# EAGLE design schema_v1 (EAGLE 7.6.0)
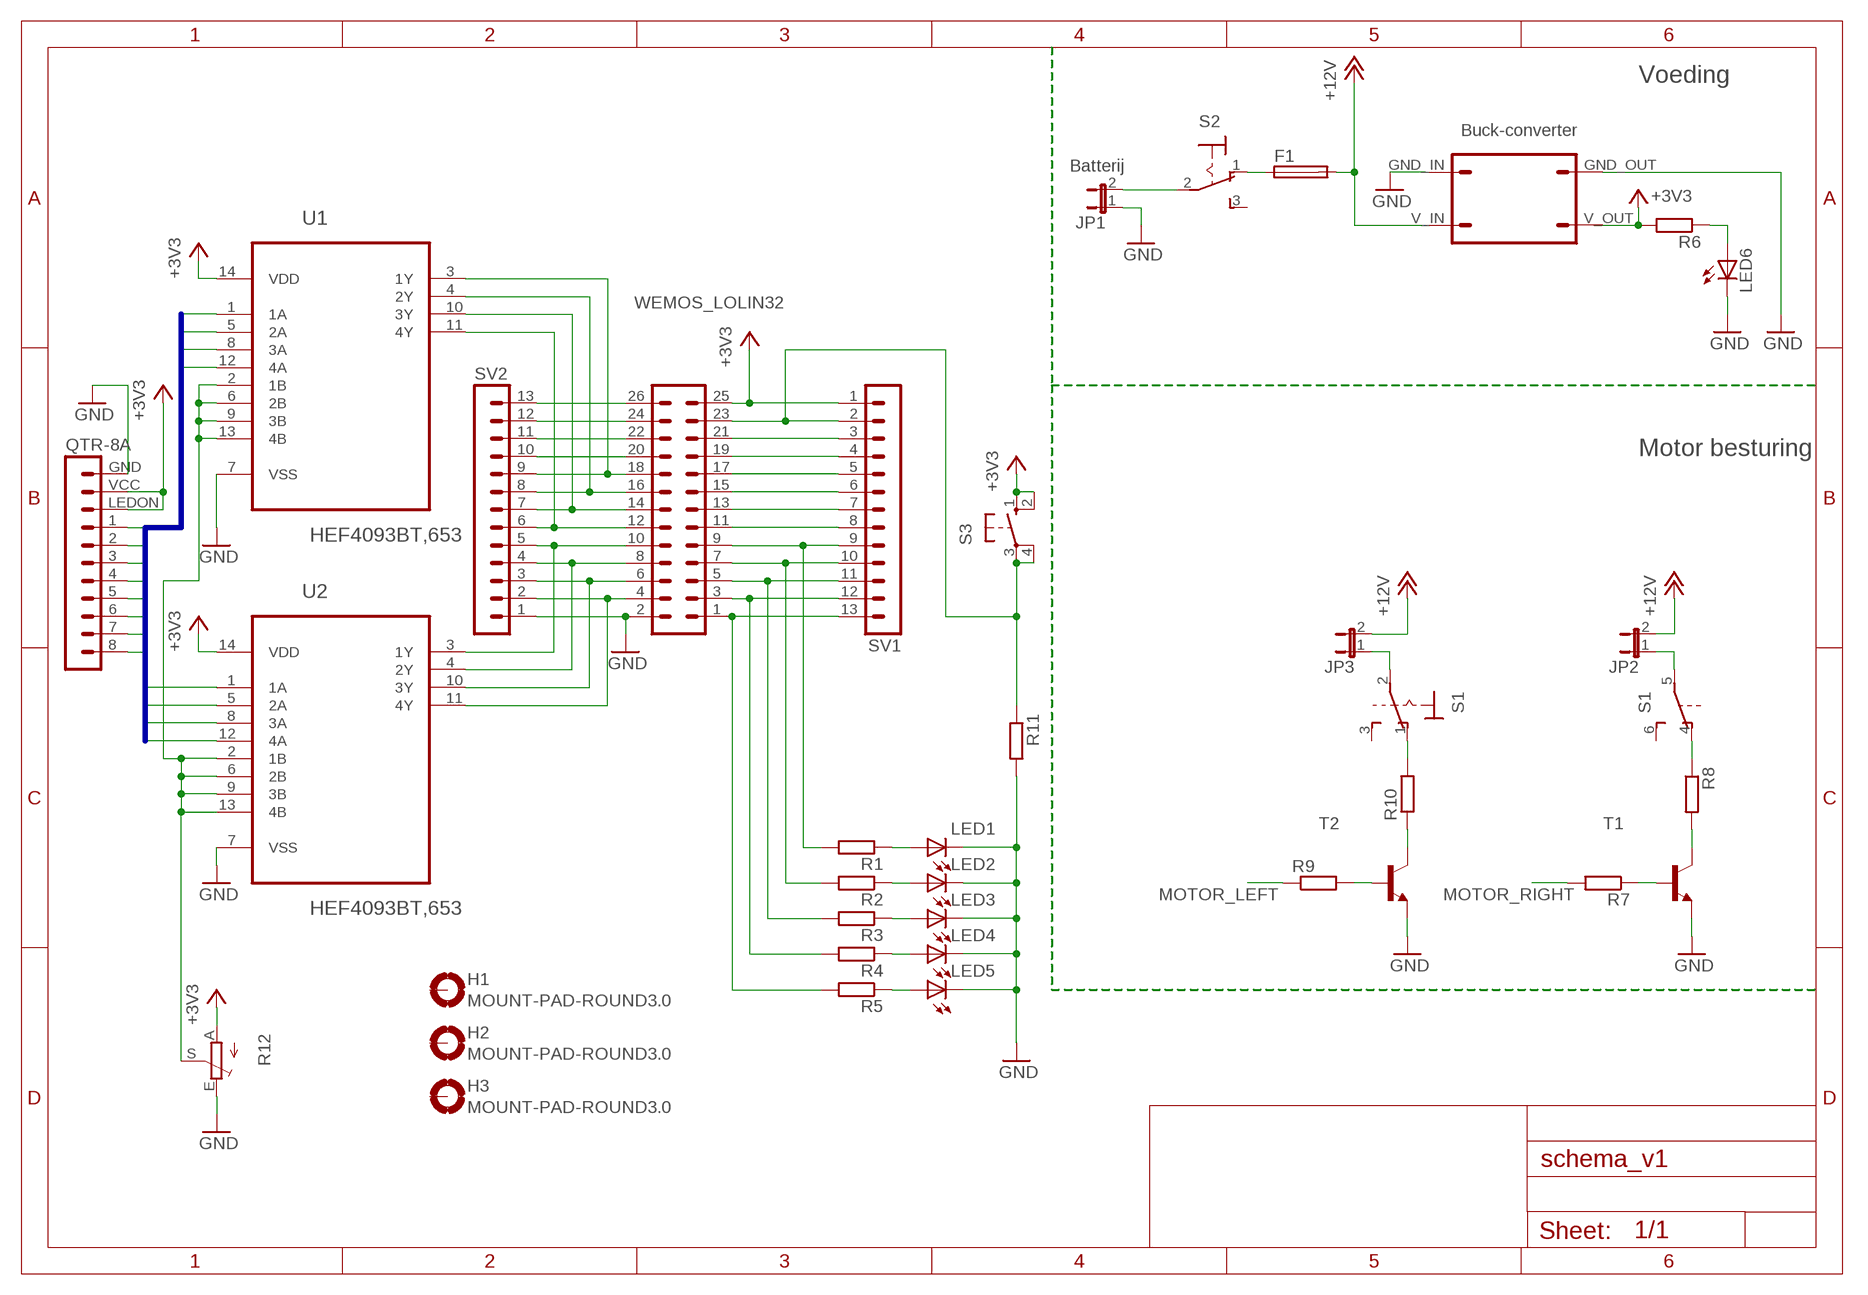
[diagram p0: schematic, sheet 1]

## Parts
F1  SH22,5A  [SH22,5A]
H1  MOUNT-PAD-ROUND3.0  [3,0-PAD]
H2  MOUNT-PAD-ROUND3.0  [3,0-PAD]
H3  MOUNT-PAD-ROUND3.0  [3,0-PAD]
JP1  JP1E  [JP1]
JP2  JP1E  [JP1]
JP3  JP1E  [JP1]
LED1  LEDSMT1206  [1206]
LED2  LEDSMT1206  [1206]
LED3  LEDSMT1206  [1206]
LED4  LEDSMT1206  [1206]
LED5  LEDSMT1206  [1206]
LED6  LEDSMT1206  [1206]
QTR-8A  WEMOS-LOLIN32_QTR-8A  [WEMOS-LOLIN32_MA10-1]
R1  R-EU_M0805  [M0805]
R2  R-EU_M0805  [M0805]
R3  R-EU_M0805  [M0805]
R4  R-EU_M0805  [M0805]
R5  R-EU_M0805  [M0805]
R6  R-EU_M0805  [M0805]
R7  R-EU_M0805  [M0805]
R8  R-EU_M0805  [M0805]
R9  R-EU_M0805  [M0805]
R10  R-EU_M0805  [M0805]
R11  R-EU_M0805  [M0805]
R12  POT_TRIM_EU-CA6V  [POT_CA6V]
S1  SWITCH_320-938  [SWITCH_320-938]
S2  SWITCH_320-916  [SWITCH_320-916]
S3  SWITCH-OMRON_10-XX  [SWITCH-OMRON_B3F-10XX]
SV1  MA13-1  [MA13-1]
SV2  MA13-1  [MA13-1]
T1  TRANSISTOR-NPN-LINE-FOLLOWER_2N2222  [TRANSISTOR-NPN-LINE-FOLLOWER_TO92-CBE]
T2  TRANSISTOR-NPN-LINE-FOLLOWER_2N2222  [TRANSISTOR-NPN-LINE-FOLLOWER_TO92-CBE]
U1  HEF4093BT,653  [SOIC127P600X175-14N]
U2  HEF4093BT,653  [SOIC127P600X175-14N]
U$2  COMPONENTEN-AANMAKEN_BUCK-CONVERTER  [COMPONENTEN-AANMAKEN_MA04-1_BUCK]
WEMOS_LOLIN32  WEMOS-LOLIN32_WEMOS_LOLIN32  [WEMOS-LOLIN32_MA13-2]

## Nets
+3V3: QTR-8A.LEDON QTR-8A.VCC R6.2 R12.A S3.1(S) S3.2(S1) SV1.1 U1.14(VDD) U2.14(VDD) U$2.V_OUT WEMOS_LOLIN32.25
+12V: F1.2 JP2.2 JP3.2 U$2.V_IN
ANALOG_BUS1: QTR-8A.1 U1.1(1A)
ANALOG_BUS2: QTR-8A.2 U1.5(2A)
ANALOG_BUS3: QTR-8A.3 U1.8(3A)
ANALOG_BUS4: QTR-8A.4 U1.12(4A)
ANALOG_BUS5: QTR-8A.5 U2.1(1A)
ANALOG_BUS6: QTR-8A.6 U2.5(2A)
ANALOG_BUS7: QTR-8A.7 U2.8(3A)
ANALOG_BUS8: QTR-8A.8 U2.12(4A)
GND: JP1.1 LED1.C LED2.C LED3.C LED4.C LED5.C LED6.C QTR-8A.GND R11.2 R12.E SV2.1 T1.E T2.E U1.7(VSS) U2.7(VSS) U$2.GND_IN U$2.GND_OUT WEMOS_LOLIN32.2
MOTOR_LEFT: R9.1 SV1.6 WEMOS_LOLIN32.15
MOTOR_RIGHT: R7.2 SV1.7 WEMOS_LOLIN32.13
N$1: JP1.2 S2.2(P)
N$2: F1.1 S2.1(O)
N$3: SV2.9 U1.3(1Y) WEMOS_LOLIN32.18
N$4: LED6.A R6.1
N$5: SV2.8 U1.4(2Y) WEMOS_LOLIN32.16
N$6: SV2.7 U1.10(3Y) WEMOS_LOLIN32.14
N$7: SV2.6 U1.11(4Y) WEMOS_LOLIN32.12
N$8: SV2.2 U2.11(4Y) WEMOS_LOLIN32.4
N$9: LED1.A R1.1
N$10: LED2.A R2.1
N$11: LED3.A R3.1
N$12: LED4.A R4.1
N$13: LED5.A R5.1
N$14: R11.1 S3.3(P) S3.4(P1) SV1.2 WEMOS_LOLIN32.23
N$15: JP3.1 S1.2(1:P)
N$16: R10.2 S1.1(1:O)
N$17: R10.1 T2.C
N$18: R9.2 T2.B
N$19: JP2.1 S1.5(B:P)
N$20: R8.1 S1.4(B:O)
N$21: R8.2 T1.C
N$22: R7.1 T1.B
N$23: SV2.3 U2.10(3Y) WEMOS_LOLIN32.6
N$24: SV2.4 U2.4(2Y) WEMOS_LOLIN32.8
N$25: SV2.5 U2.3(1Y) WEMOS_LOLIN32.10
N$26: SV2.10 WEMOS_LOLIN32.20
N$27: SV2.11 WEMOS_LOLIN32.22
N$28: SV2.12 WEMOS_LOLIN32.24
N$29: SV2.13 WEMOS_LOLIN32.26
N$30: R5.2 SV1.13 WEMOS_LOLIN32.1
N$31: R12.S U1.2(1B) U1.6(2B) U1.9(3B) U1.13(4B) U2.2(1B) U2.6(2B) U2.9(3B) U2.13(4B)
N$32: R4.2 SV1.12 WEMOS_LOLIN32.3
N$33: R3.2 SV1.11 WEMOS_LOLIN32.5
N$35: R2.2 SV1.10 WEMOS_LOLIN32.7
N$36: R1.2 SV1.9 WEMOS_LOLIN32.9
N$38: SV1.3 WEMOS_LOLIN32.21
N$39: SV1.4 WEMOS_LOLIN32.19
N$40: SV1.5 WEMOS_LOLIN32.17
N$43: SV1.8 WEMOS_LOLIN32.11
Unconnected: H1.B3,0(MOUNT) H2.B3,0(MOUNT) H3.B3,0(MOUNT) S1.3(1:S) S1.6(B:S) S2.3(S)

## Buses
ANALOG_BUS[1..8]

## Notes on the sheet
- Voeding
- Buck-converter
- Batterij
- Motor besturing

## Library data of the parts
F1 = fuse:SH22,5A: FUSE HOLDER grid 22,5mm, isolated cap OGN0031 8201, Schurter (Buerklin); MPN: 0031.7701.11; OC_FARNELL: unknown; OC_NEWARK: 04F1224
H1-H3 = holes:MOUNT-PAD-ROUND: MOUNTING PAD, round
JP1-JP3 = schema 2017-02-28:JP1E: JUMPER
LED1-LED6 = led:LED: LED OSRAM: - CHIPLED LG R971, LG N971, LY N971, LG Q971, LY Q971, LO R971, LY R971 LH N974, LH R974 LS Q976, LO Q976, LY Q976 LO Q996 - Hyper CHIPLED LW Q18S LB Q993, LB Q99A, LB R99A - SideLED LS A670, LO A670, LY A670, LG A670, LP A670 LB A673, LV A673, LT A673, LW A673 LH A674 LY A675 LS A676, LA A676, LO A676, LY A676, LW A676 LS A679, LY A679, LG A679 - Hyper Micro SIDELED® LS Y876, LA Y876, LO Y876, LY Y876 LT Y87S - SmartLED LW L88C, LW L88S LB L89C, LB L89S, LG L890 LS L89K, LO L89K, LY L89K LS L896, LA L896, LO L896, LY L896 - TOPLED LS T670, LO T670, LY T670, LG T670, LP T670 LSG T670, LSP T670, LSY T670, LOP T670, LYG T670 LG T671, LOG T671, LSG T671 LB T673, LV T673, LT T673, LW T673 LH T674 LS T676, LA T676, LO T676, LY T676, LB T676, LH T676, LSB T676, LW T676 LB T67C, LV T67C, LT T67C, LS T67K, LO T67K, LY T67K, LW E67C LS E67B, LA E67B, LO E67B, LY E67B, LB E67C, LV E67C, LT E67C LW T67C LS T679, LY T679, LG T679 LS T770, LO T770, LY T770, LG T770, LP T770 LB T773, LV T773, LT T773, LW T773 LH T774 LS E675, LA E675, LY E675, LS T675 LS T776, LA T776, LO T776, LY T776, LB T776 LHGB T686 LT T68C, LB T68C - Hyper Mini TOPLED® LB M676 - Mini TOPLED Santana® LG M470 LS M47K, LO M47K, LY M47K Source: http://www.osram.convergy.de LUXEON: - LUMILED® LXK2-PW12-R00, LXK2-PW12-S00, LXK2-PW14-U00, LXK2-PW14-V00 LXK2-PM12-R00, LXK2-PM12-S00, LXK2-PM14-U00 LXK2-PE12-Q00, LXK2-PE12-R00, LXK2-PE12-S00, LXK2-PE14-T00, LXK2-PE14-U00 LXK2-PB12-K00, LXK2-PB12-L00, LXK2-PB12-M00, LXK2-PB14-N00, LXK2-PB14-P00, LXK2-PB14-Q00 LXK2-PR12-L00, LXK2-PR12-M00, LXK2-PR14-Q00, LXK2-PR14-R00 LXK2-PD12-Q00, LXK2-PD12-R00, LXK2-PD12-S00 LXK2-PH12-R00, LXK2-PH12-S00 LXK2-PL12-P00, LXK2-PL12-Q00, LXK2-PL12-R00 Source: www.luxeon.com KINGBRIGHT: KA-3528ASYC Source: www.kingbright.com
QTR-8A = schema:WEMOS-LOLIN32_QTR-8A: PIN HEADER; OC_FARNELL: unknown; OC_NEWARK: unknown
R1-R11 = resistor:R-EU_: RESISTOR, European symbol
R12 = schema:POT_TRIM_EU-: POTENTIOMETER
S1 = schema:SWITCH_320-938: TOGGLE SWITCH distributor RS Components
S2 = schema:SWITCH_320-916: TOGGLE SWITCH distributor RS Components
S3 = schema:SWITCH-OMRON_10-XX: OMRON SWITCH; MPN: B3F-1000; OC_FARNELL: 176432; OC_NEWARK: 36M3542
SV1 SV2 = con-lstb:MA13-1: PIN HEADER; OC_FARNELL: unknown; OC_NEWARK: unknown
T1 T2 = schema:TRANSISTOR-NPN-LINE-FOLLOWER_2N2222: NPN Transistor
U1 U2 = HEF4093:HEF4093BT,653: Quad 2-input NAND Schmitt trigger; MPN: HEF4093BT,653; OC_FARNELL: 1826634; OC_NEWARK: 78R7394; PACKAGE: SOIC-14; SUPPLIER: NXP
U$2 = schema:COMPONENTEN-AANMAKEN_BUCK-CONVERTER
WEMOS_LOLIN32 = schema:WEMOS-LOLIN32_WEMOS_LOLIN32

## Board
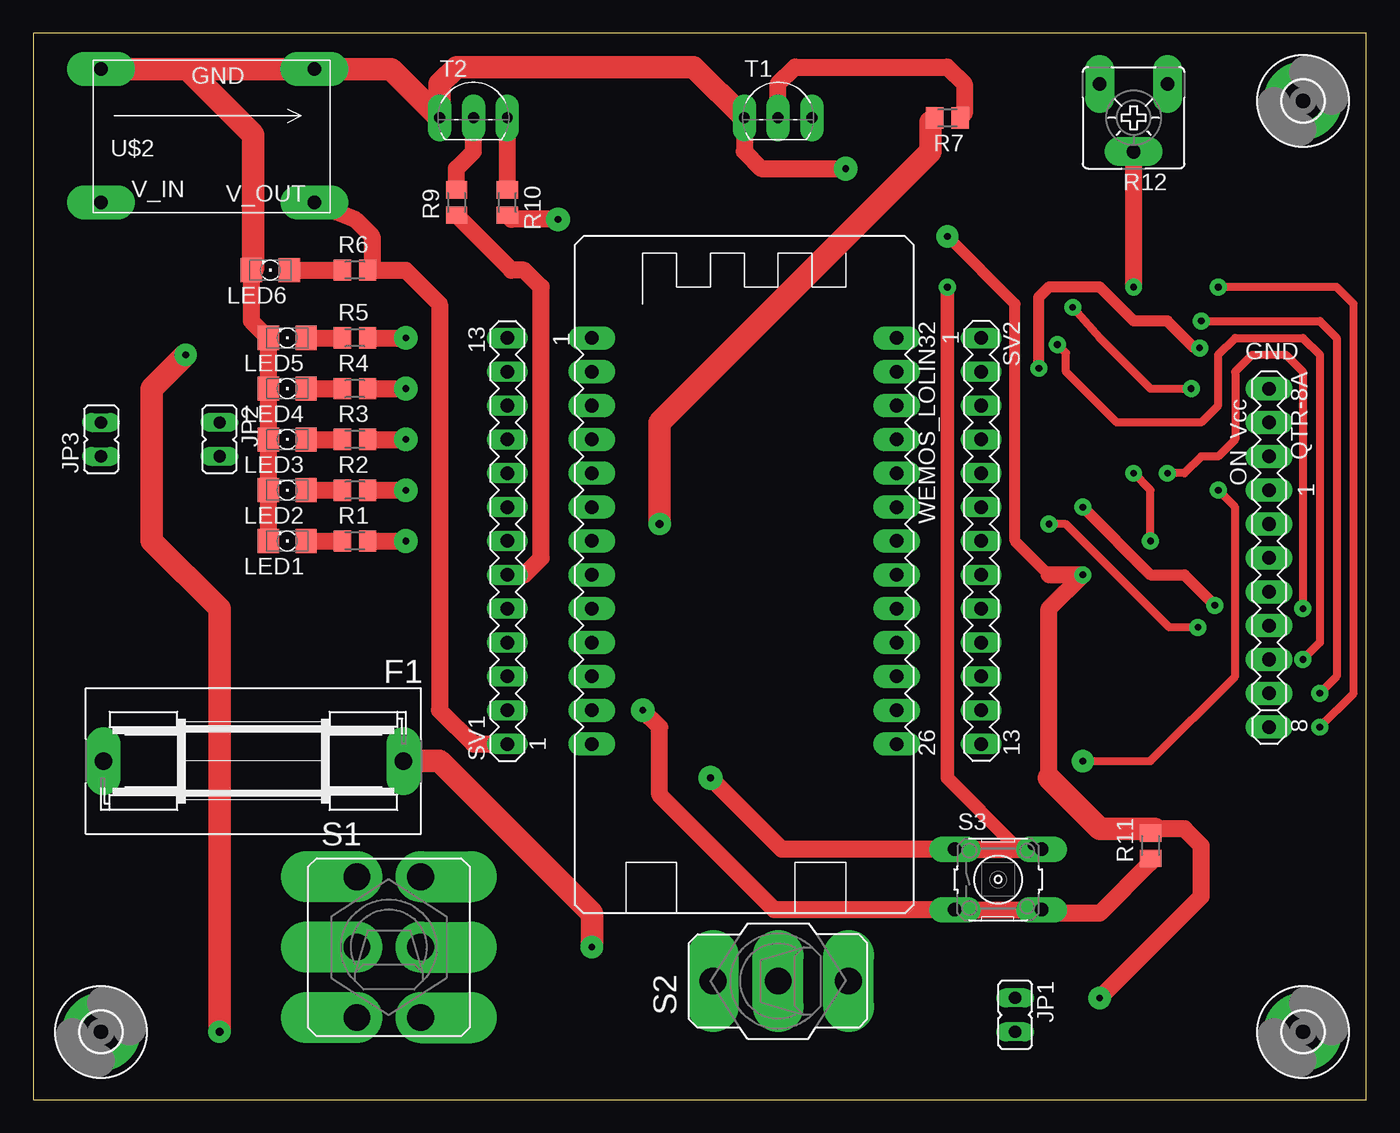
[diagram p1: board, top side]
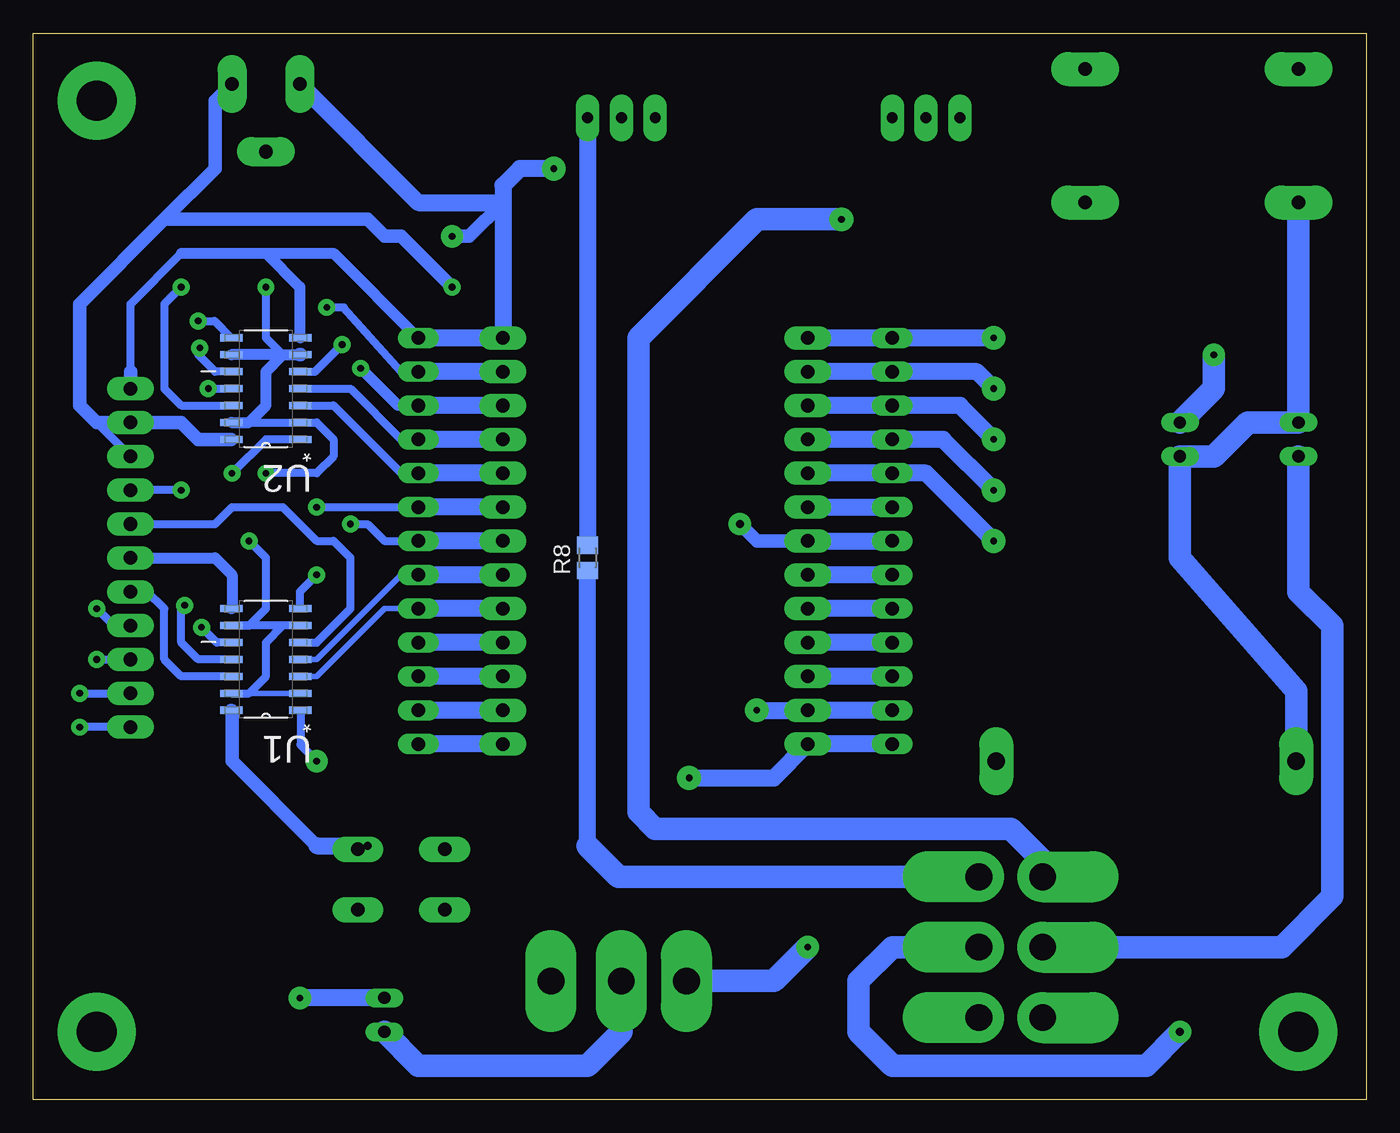
[diagram p2: board, bottom side, seen from below]

Size 100 x 80 mm. Coordinates in mm from the lower left corner, seen from the top.
Outline: 0,0 100,0 100,80 0,80 0,0
Copper layers (1*16): Top 0.035mm / dielectric 1.5mm / Bottom 0.035mm
Design rules "default": minimum track width 6mil, minimum drill 0.35mm, track to track 6mil, track to pad 6mil, pad to pad 6mil, via to via 6mil, smd to smd 6mil, copper to edge 40mil, drill to drill 6mil, minimum pad ring 10mil, minimum via ring 8mil, stop-mask expansion 4mil, vias tented up to drill 0mil, thermal gap 10mil

### Footprints (pad centres in the part's own frame; a part is rotated, then mirrored left to right if it is on the bottom)
SH22,5A = drill 1.321 pad 2.54 long: 1 -11.252,0; 2 11.252,0
3,0-PAD = drill 3 pad 5.842: B3,0 0,0
JP1 = drill 0.914 long: 1 0,-1.27; 2 0,1.27
1206 = smd 1.6 x 1.803: A -1.422,0; C 1.422,0
WEMOS-LOLIN32_MA10-1 = drill 1.016 pad 1.778 long: 1 -3.81,0; 2 -1.27,0; 3 1.27,0; 4 3.81,0; 5 6.35,0; 6 8.89,0; 7 11.43,0; 8 13.97,0; GND -11.43,0; LEDON -6.35,0; VCC -8.89,0
M0805 = smd 1.3 x 1.6: 1 -0.95,0; 2 0.95,0
POT_CA6V = drill 1.016 pad 2.184 long: A -2.54,-2.54; E 2.54,-2.54; S 0,2.54
SWITCH_320-938 = drill 2.007 pad 3.81 offset: 1 -2.388,5.283; 2 -2.388,0; 3 -2.388,-5.283; 4 2.388,5.283; 5 2.388,0; 6 2.388,-5.283
SWITCH_320-916 = drill 2.007 pad 3.81 long: 1 0,4.877; 2 0,0; 3 0,-5.283
SWITCH-OMRON_B3F-10XX = drill 1.016 pad 1.93 long: 1 -3.251,2.261; 2 3.251,2.261; 3 -3.251,-2.261; 4 3.251,-2.261
MA13-1 = drill 1.016 long: 1 -15.24,0; 2 -12.7,0; 3 -10.16,0; 4 -7.62,0; 5 -5.08,0; 6 -2.54,0; 7 0,0; 8 2.54,0; 9 5.08,0; 10 7.62,0; 11 10.16,0; 12 12.7,0; 13 15.24,0
TRANSISTOR-NPN-LINE-FOLLOWER_TO92-CBE = drill 0.813 pad 1.778 long: B 0,0; C 2.54,0; E -2.54,0
SOIC127P600X175-14N = smd 1.702 x 0.533: 1 -2.591,3.81; 2 -2.591,2.54; 3 -2.591,1.27; 4 -2.591,0; 5 -2.591,-1.27; 6 -2.591,-2.54; 7 -2.591,-3.81; 8 2.591,-3.81; 9 2.591,-2.54; 10 2.591,-1.27; 11 2.591,0; 12 2.591,1.27; 13 2.591,2.54; 14 2.591,3.81
COMPONENTEN-AANMAKEN_MA04-1_BUCK = drill 1.016 pad 2.54 long: GND_IN 0,10; GND_OUT 16,10; V_IN 0,0; V_OUT 16,0
WEMOS-LOLIN32_MA13-2 = drill 1.016 pad 1.778 long: 1 -15.24,-1.27; 2 -15.24,21.59; 3 -12.7,-1.27; 4 -12.7,21.59; 5 -10.16,-1.27; 6 -10.16,21.59; 7 -7.62,-1.27; 8 -7.62,21.59; 9 -5.08,-1.27; 10 -5.08,21.59; 11 -2.54,-1.27; 12 -2.54,21.59; 13 0,-1.27; 14 0,21.59; 15 2.54,-1.27; 16 2.54,21.59; 17 5.08,-1.27; 18 5.08,21.59; 19 7.62,-1.27; 20 7.62,21.59; 21 10.16,-1.27; 22 10.16,21.59; 23 12.7,-1.27; 24 12.7,21.59; 25 15.24,-1.27; 26 15.24,21.59

### Placement (x,y rotation side)
F1  16.51,25.4 180 top
H1  95.25,5.08 0 top
H2  95.25,74.93 0 top
H3  5.08,5.08 0 top
JP1  73.66,6.35 180 top
JP2  13.97,49.53 180 top
JP3  5.08,49.53 0 top
LED1  19.05,41.91 180 top
LED2  19.05,45.72 180 top
LED3  19.05,49.53 180 top
LED4  19.05,53.34 180 top
LED5  19.05,57.15 180 top
LED6  17.78,62.23 180 top
QTR-8A  92.71,41.91 270 top
R1  24.13,41.91 0 top
R2  24.13,45.72 0 top
R3  24.13,49.53 0 top
R4  24.13,53.34 0 top
R5  24.13,57.15 0 top
R6  24.13,62.23 0 top
R7  68.58,73.66 180 top
R8  58.42,40.64 90 bottom
R9  31.75,67.31 90 top
R10  35.56,67.31 270 top
R11  83.82,19.05 90 top
R12  82.55,73.66 180 top
S1  26.67,11.43 0 top
S2  55.88,8.89 90 top
S3  72.39,16.51 0 top
SV1  35.56,41.91 90 top
SV2  71.12,41.91 270 top
T1  55.88,73.66 0 top
T2  33.02,73.66 0 top
U1  82.55,33.02 180 bottom
U2  82.55,53.34 180 bottom
U$2  5.08,67.31 0 top
WEMOS_LOLIN32  43.18,41.91 270 top

### Tracks (layer width: path | path; a pad name or v marks a point on that pad's centre or on a via)
+3V3  (via drill 0.5 pad 1.27, 0.5 pad 1.78, 0.6)
  Top 1.016: v68.58,60.96 68.58,24.13 73.66,19.05 | S3.2 73.94,18.77 73.66,19.05 | 73.66,19.05 v74.93,19.05
  Top 1.27: U$2.V_OUT 24.13,66.04 25.4,64.77 25.4,62.55 R6.2 27.94,62.23 30.48,59.69 30.48,29.21 33.02,26.67 SV1.1 | S3.2 S3.1 56.16,18.77 v50.8,24.13
  Bottom 0.61: QTR-8A.LEDON 95.25,50.8
  Bottom 1.016: R12.A 86.36,74.93 86.36,69.85 90.17,66.04 | 90.17,66.04 96.52,59.69 96.52,52.07 95.25,50.8 QTR-8A.VCC 88.9,50.8 87.63,49.53 U2.14 | v68.58,60.96 72.39,64.77 73.66,64.77 74.93,66.04 90.17,66.04 | 78.74,19.05 85.09,25.4 85.09,29.16 U1.14
  Bottom 1.27: SV1.1 WEMOS_LOLIN32.25 44.45,24.13 v50.8,24.13 | 78.74,19.05 v74.93,19.05
+12V
  Bottom 1.676: U$2.V_IN JP3.2 8.89,50.8 11.43,48.26 JP2.2 13.97,40.64 5.26,30.66 F1.2
ANALOG_BUS1  (via drill 0.5 pad 1.27, 0.5 pad 1.68)
  Top 0.61: v78.74,25.4 83.82,25.4 90.17,31.75 90.17,44.45 v88.9,45.72
  Bottom 0.61: U1.1 79.96,26.62 v78.74,25.4 | v88.9,45.72 QTR-8A.1
ANALOG_BUS2
  Bottom 0.61: U1.5 78.74,34.29 76.2,36.83 76.2,40.64 77.47,41.91 78.74,41.91 81.28,44.45 85.09,44.45 86.36,43.18 QTR-8A.2
ANALOG_BUS3
  Bottom 0.813: QTR-8A.3 86.36,40.64 85.09,39.37 85.09,36.88 U1.8
ANALOG_BUS4
  Bottom 0.61: U1.12 88.9,31.75 90.17,33.02 90.17,36.83 91.44,38.1 QTR-8A.4
ANALOG_BUS5  (via drill 0.5 pad 1.27)
  Top 0.61: v95.25,36.83 95.25,54.61 93.98,55.88 91.44,55.88 90.17,54.61 90.17,49.53 88.9,48.26 87.63,48.26 86.36,46.99 v85.09,46.99
  Bottom 0.61: U2.1 82.55,49.53 v85.09,46.99 | v95.25,36.83 93.98,35.56 QTR-8A.5
ANALOG_BUS6  (via drill 0.5 pad 1.27)
  Top 0.61: v95.25,33.02 96.52,34.29 96.52,55.88 95.25,57.15 90.17,57.15 88.9,55.88 88.9,52.07 87.63,50.8 81.28,50.8 77.47,54.61 77.47,56.01 v76.83,56.64
  Bottom 0.61: v95.25,33.02 QTR-8A.6 | U2.5 78.87,54.61 v76.83,56.64
ANALOG_BUS7  (via drill 0.5 pad 1.27)
  Top 0.61: v87.63,58.42 96.52,58.42 97.79,57.15 97.79,31.75 v96.52,30.48
  Bottom 0.61: v96.52,30.48 QTR-8A.7 | v87.63,58.42 86.41,58.42 U2.8
ANALOG_BUS8  (via drill 0.5 pad 1.27)
  Top 0.61: v96.52,27.94 99.06,30.48 99.06,59.69 97.79,60.96 v88.9,60.96
  Bottom 0.61: QTR-8A.8 v96.52,27.94 | v88.9,60.96 90.17,59.69 90.17,53.34 88.9,52.07 U2.12
GND  (via drill 0.5 pad 1.27, 0.5 pad 1.68, 0.5 pad 1.78)
  Top 0.813: 76.2,39.37 73.66,41.91 73.66,59.69 v68.58,64.77
  Top 1.27: LED1.C LED2.C LED3.C LED4.C LED5.C 16.36,58.42 LED6.C 16.51,62.38 | v80.01,7.62 87.63,15.24 87.63,19.05 86.36,20.32 84.14,20.32 R11.2 | U$2.GND_OUT 20.16,77.31 | U$2.GND_IN 11.59,77.31 | T1.E 53.34,71.12 54.61,69.85 v60.96,69.85 | 76.2,24.13 76.2,36.83 v78.74,39.37 76.2,39.37
  Top 1.676: U$2.GND_OUT 26.83,77.31 T2.E 30.48,76.2 31.75,77.47 49.53,77.47 T1.E | 16.51,62.38 16.51,72.39 11.59,77.31 | 84.14,20.32 80.01,20.32 76.2,24.13 | 20.16,77.31 U$2.GND_IN
  Bottom 0.61: v78.74,39.37 80.01,38.1 80.01,36.88 U1.7 | 92.71,54.61 92.71,59.69 88.9,63.5
  Bottom 0.813: 88.9,63.5 82.55,63.5 | U2.7 80.01,57.2 80.01,60.96 82.55,63.5 | 82.55,63.5 77.47,63.5 SV2.1
  Bottom 1.016: QTR-8A.GND 92.71,54.61 | v68.58,64.77 67.31,64.77 64.77,67.31
  Bottom 1.27: SV2.1 WEMOS_LOLIN32.2 64.77,67.31 | v60.96,69.85 63.5,69.85 64.77,68.58 64.77,67.31 | R12.E 71.12,67.31 64.77,67.31 | JP1.1 v80.01,7.62
MOTOR_LEFT
  Top 1.27: SV1.6 36.83,39.37 38.1,40.64 38.1,60.96 36.83,62.23 35.88,62.23 R9.1
  Bottom 1.27: SV1.6 WEMOS_LOLIN32.15
MOTOR_RIGHT  (via drill 0.6 pad 1.68)
  Top 1.016: 67.31,73.34 R7.2
  Top 1.676: v46.99,43.18 46.99,50.8 67.31,71.12 67.31,73.34
  Bottom 1.016: WEMOS_LOLIN32.13 45.72,41.91 v46.99,43.18
  Bottom 1.27: WEMOS_LOLIN32.13 SV1.7
N$1
  Bottom 1.676: S2.2 55.88,5.08 58.42,2.54 71.12,2.54 JP1.2
N$2  (via drill 0.5 pad 1.68)
  Top 1.676: F1.1 30.48,25.4 41.91,13.97 v41.91,11.43
  Bottom 1.676: S2.1 44.45,8.89 v41.91,11.43
N$3
  Bottom 0.406: U1.3 78.74,31.75 73.66,36.83 SV2.9
  Bottom 1.27: WEMOS_LOLIN32.18 SV2.9
N$4
  Top 1.27: LED6.A R6.1
N$5
  Bottom 0.406: U1.4 78.74,33.02 72.39,39.37 SV2.8
  Bottom 1.27: WEMOS_LOLIN32.16 SV2.8
N$6  (via drill 0.5 pad 1.27)
  Top 0.61: v76.2,43.18 77.47,43.18 85.22,35.43 v87.38,35.43
  Bottom 0.61: v76.2,43.18 74.93,43.18 73.66,41.91 SV2.7 | U1.10 86.23,34.29 v87.38,35.43
  Bottom 1.27: WEMOS_LOLIN32.14 SV2.7
N$7  (via drill 0.5 pad 1.27)
  Top 0.813: v78.74,44.45 83.82,39.37 86.36,39.37 v88.65,37.08
  Bottom 0.61: v78.74,44.45 SV2.6 | U1.11 87.63,33.02 88.9,34.29 88.9,36.83 v88.65,37.08
  Bottom 1.27: WEMOS_LOLIN32.12 SV2.6
N$8  (via drill 0.5 pad 1.27)
  Top 0.61: v77.98,59.44 80.01,57.15 83.82,53.34 v86.87,53.34
  Bottom 0.61: SV2.2 72.39,54.61 76.71,59.44 v77.98,59.44 | v86.87,53.34 U2.11
  Bottom 1.27: WEMOS_LOLIN32.4 SV2.2
N$9
  Top 1.27: LED1.A R1.1
N$10
  Top 1.27: LED2.A R2.1
N$11
  Top 1.27: LED3.A R3.1
N$12
  Top 1.27: LED4.A R4.1
N$13
  Top 1.27: LED5.A R5.1
N$14  (via drill 0.5 pad 1.78)
  Top 1.27: R11.1 83.82,17.78 80.01,13.97 75.92,13.97 S3.4 S3.3 55.6,14.25 46.99,22.86 46.99,27.94 v45.72,29.21
  Bottom 1.27: SV1.2 WEMOS_LOLIN32.23 v45.72,29.21
N$15
  Bottom 1.676: S1.2 6.35,11.43 2.54,15.24 2.54,35.56 5.08,38.1 JP3.1
N$16  (via drill 0.5 pad 1.78)
  Top 1.27: v39.37,66.04 35.88,66.04 R10.2
  Bottom 1.676: S1.1 24.28,17.93 26.67,20.32 53.34,20.32 54.61,21.59 54.61,57.15 45.72,66.04 v39.37,66.04
N$17
  Top 1.27: T2.C R10.1
N$18
  Top 1.27: R9.2 31.75,69.85 33.02,71.12 T2.B
N$19  (via drill 0.5 pad 1.68, 0.6 pad 1.68)
  Top 1.676: v13.97,5.08 13.97,36.83 8.89,41.91 8.89,53.34 v11.43,55.88
  Bottom 1.676: S1.5 35.56,11.43 38.1,8.89 38.1,5.08 35.56,2.54 16.51,2.54 v13.97,5.08 | v11.43,55.88 11.43,53.34 JP2.1
N$20
  Bottom 1.27: 58.42,19.05 R8.1
  Bottom 1.676: S1.4 56.08,16.71 58.42,19.05
N$21
  Bottom 1.27: T1.C R8.2
N$22
  Top 1.27: T1.B 55.88,76.2 57.15,77.47 68.58,77.47 69.85,76.2 69.85,73.98 R7.1
N$23  (via drill 0.5 pad 1.27)
  Top 0.61: v87.5,56.39 87.12,56.39
  Top 0.813: 87.12,56.39 85.09,58.42 82.55,58.42 80.01,60.96 76.2,60.96 75.44,60.2 v75.44,54.86
  Bottom 0.61: U2.10 86.36,54.61 87.63,55.88 87.63,56.26 v87.5,56.39 | 72.39,52.07 72.64,52.07
  Bottom 0.813: SV2.3 72.39,52.07 | 72.64,52.07 v75.44,54.86
  Bottom 1.27: WEMOS_LOLIN32.6 SV2.3
N$24
  Bottom 0.61: U2.4 76.2,53.34 72.39,49.53 SV2.4
  Bottom 1.27: WEMOS_LOLIN32.8 SV2.4
N$25
  Bottom 0.61: U2.3 77.47,52.07 72.39,46.99 SV2.5
  Bottom 1.27: WEMOS_LOLIN32.10 SV2.5
N$26
  Bottom 1.27: WEMOS_LOLIN32.20 SV2.10
N$27
  Bottom 1.27: WEMOS_LOLIN32.22 SV2.11
N$28
  Bottom 1.27: WEMOS_LOLIN32.24 SV2.12
N$29
  Bottom 1.27: WEMOS_LOLIN32.26 SV2.13
N$30  (via drill 0.5 pad 1.78)
  Top 1.27: R5.2 v27.94,57.15
  Bottom 1.27: WEMOS_LOLIN32.1 SV1.13 v27.94,57.15
N$31  (via drill 0.5 pad 1.27)
  Top 0.61: v83.82,41.91 83.82,45.72 v82.55,46.99
  Top 1.27: v82.55,60.96 R12.S
  Bottom 0.406: U1.2 U1.13
  Bottom 0.61: U1.6 81.28,35.56 | 81.28,35.56 U1.9 83.82,35.56 82.55,36.83 82.55,40.64 v83.82,41.91 | U1.13 83.82,30.48 82.55,31.75 82.55,34.29 81.28,35.56 | U2.13 U2.2 78.74,50.8 77.47,49.53 77.47,48.26 78.74,46.99 v82.55,46.99 | 81.28,55.88 82.55,57.15 v82.55,60.96
  Bottom 0.813: U2.13 83.82,50.8 82.55,52.07 82.55,54.61 81.28,55.88 | 81.28,55.88 U2.6 | 81.28,55.88 U2.9
  Bottom 1.016: U2.6 80.01,55.88
N$32  (via drill 0.5 pad 1.78)
  Top 1.27: R4.2 v27.94,53.34
  Bottom 1.27: WEMOS_LOLIN32.3 SV1.12 29.21,54.61 v27.94,53.34
N$33  (via drill 0.5 pad 1.78)
  Top 1.27: R3.2 v27.94,49.53
  Bottom 1.27: WEMOS_LOLIN32.5 SV1.11 30.48,52.07 v27.94,49.53
N$35  (via drill 0.5 pad 1.78)
  Top 1.27: R2.2 v27.94,45.72
  Bottom 1.27: WEMOS_LOLIN32.7 SV1.10 31.75,49.53 v27.94,45.72
N$36  (via drill 0.5 pad 1.78)
  Top 1.27: R1.2 v27.94,41.91
  Bottom 1.27: WEMOS_LOLIN32.9 SV1.9 33.02,46.99 v27.94,41.91
N$38
  Bottom 1.27: SV1.3 WEMOS_LOLIN32.21
N$39
  Bottom 1.27: SV1.4 WEMOS_LOLIN32.19
N$40
  Bottom 1.27: SV1.5 WEMOS_LOLIN32.17
N$43
  Bottom 1.27: WEMOS_LOLIN32.11 SV1.8